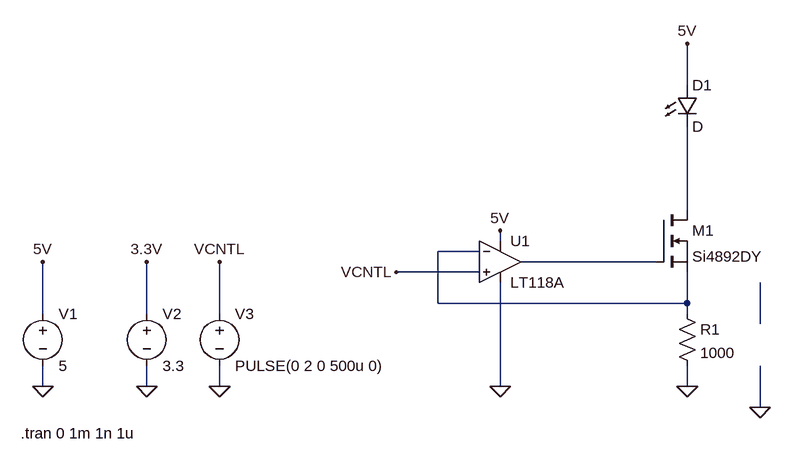
[diagram p0: schematic transmitter.asc]
transmitter.asc, the LTspice schematic file:
Version 4
SHEET 1 956 680
WIRE 784 -288 784 -352
WIRE 784 -96 784 -224
WIRE 496 -48 496 -64
WIRE 464 -32 400 -32
WIRE 736 -16 528 -16
WIRE 464 0 336 0
WIRE 400 48 400 -32
WIRE 784 48 784 0
WIRE 784 48 400 48
WIRE -208 64 -208 -16
WIRE -48 64 -48 -16
WIRE 64 64 64 -16
WIRE 784 64 784 48
WIRE 896 80 896 16
WIRE -208 176 -208 144
WIRE -48 176 -48 144
WIRE 64 176 64 144
WIRE 496 176 496 16
WIRE 784 176 784 144
WIRE 896 208 896 144
FLAG -208 176 0
FLAG -208 -16 5V
FLAG 896 208 0
FLAG 784 -352 5V
FLAG -48 176 0
FLAG -48 -16 3.3V
FLAG 496 176 0
FLAG 784 176 0
FLAG 496 -64 5V
FLAG 64 176 0
FLAG 64 -16 VCNTL
FLAG 336 0 VCNTL
SYMBOL LED 768 -288 R0
SYMATTR InstName D1
SYMBOL voltage -208 48 R0
WINDOW 123 0 0 Left 0
WINDOW 39 0 0 Left 0
SYMATTR InstName V1
SYMATTR Value 5
SYMBOL res 768 48 R0
SYMATTR InstName R1
SYMATTR Value 1000
SYMBOL OpAmps\\LT118A 496 -16 R0
SYMATTR InstName U1
SYMBOL voltage -48 48 R0
WINDOW 123 0 0 Left 0
WINDOW 39 0 0 Left 0
SYMATTR InstName V2
SYMATTR Value 3.3
SYMBOL nmos 736 -96 R0
SYMATTR InstName M1
SYMATTR Value Si4892DY
SYMBOL voltage 64 48 R0
WINDOW 123 0 0 Left 0
WINDOW 39 0 0 Left 0
SYMATTR InstName V3
SYMATTR Value PULSE(0 2 0 500u 0)
TEXT -242 248 Left 2 !.tran 0 1m 1n 1u

The netlist it stands for:
* transmitter.asc
D1 5V N001 D
V1 5V 0 5
R1 N002 0 1000
* U1: LT118A (symbol OpAmps\LT118A not available, pins judged from their places): In+=VCNTL In-=N002 V+=5V V-=0 OUT=N003
V2 3.3V 0 3.3
M1 N001 N003 N002 N002 Si4892DY
V3 VCNTL 0 PULSE(0 2 0 500u 0)
.model D D
.lib standard.dio
.model NMOS NMOS
.model PMOS PMOS
.lib standard.mos
.tran 0 1m 1n 1u
.backanno
.end